# Altium schematic sheet STM-LF.SchDoc
size A4; SheetNumber: 2; SheetTotal: 6
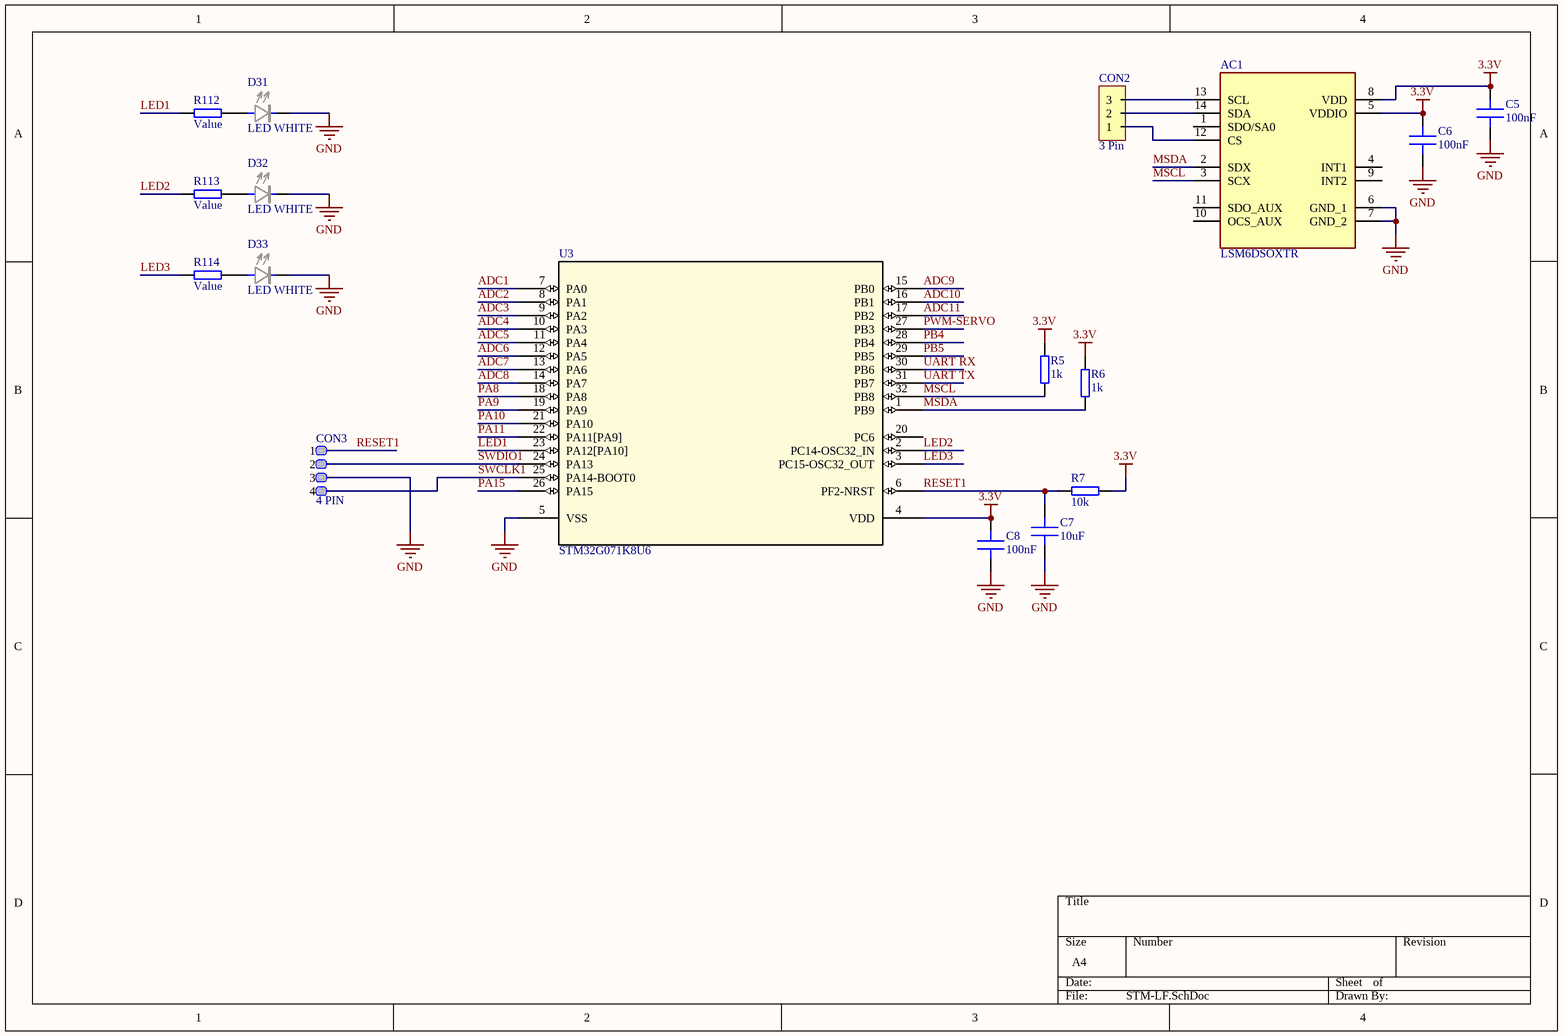
[diagram p0: STM-LF.SchDoc]

## Parts
AC1  LSM6DSOXTR  [LGA-14_1]
C5  100nF  [C 0603]
C6  100nF  [C 0603]
C7  10uF  [C 0603]
C8  100nF  [C 0603]
CON2  3 Pin  [BM03B-SRSS-TB]
CON3  4 PIN  [BM04B-SRSS-TB]
D31  LED WHITE  [LED 0603 White]
D32  LED WHITE  [LED 0603 White]
D33  LED WHITE  [LED 0603 White]
R5  1k  [R 0603]
R6  1k  [R 0603]
R7  10k  [R 0603]
R112  Value  [R 0603]
R113  Value  [R 0603]
R114  Value  [R 0603]
U3  STM32G071K8U6  [UFQFPN-32]

## Nets
3.3V: AC1.5(VDDIO) AC1.8(VDD) C5.2 C6.2 C8.2 R5.1 R6.1 R7.1 U3.4(VDD)
GND: AC1.6(GND_1) AC1.7(GND_2) C5.1 C6.1 C7.1 C8.1 CON3.3 D31.2 D32.2 D33.2 U3.5(VSS)
ADC1: U3.7(PA0)
ADC2: U3.8(PA1)
ADC3: U3.9(PA2)
ADC4: U3.10(PA3)
ADC5: U3.11(PA4)
ADC6: U3.12(PA5)
ADC7: U3.13(PA6)
ADC8: U3.14(PA7)
ADC9: U3.15(PB0)
ADC10: U3.16(PB1)
ADC11: U3.17(PB2)
LED1: R112.1 U3.23(PA12[PA10])
LED2: R113.1 U3.2(PC14-OSC32_IN)
LED3: R114.1 U3.3(PC15-OSC32_OUT)
MSCL: AC1.3(SCX) R5.2 U3.32(PB8)
MSDA: AC1.2(SDX) R6.2 U3.1(PB9)
PA8: U3.18(PA8)
PA9: U3.19(PA9)
PA10: U3.21(PA10)
PA11: U3.22(PA11[PA9])
PA15: U3.26(PA15)
PB4: U3.28(PB4)
PB5: U3.29(PB5)
PWM-SERVO: U3.27(PB3)
RESET1: C7.2 CON3.1 R7.2 U3.6(PF2-NRST)
SWCLK1: CON3.4 U3.25(PA14-BOOT0)
SWDIO1: CON3.2 U3.24(PA13)
UART RX: U3.30(PB6)
UART TX: U3.31(PB7)
NetAC1_12: AC1.12(CS) CON2.1
NetAC1_13: AC1.13(SCL) CON2.3
NetAC1_14: AC1.14(SDA) CON2.2
NetD31_1: D31.1 R112.2
NetD32_1: D32.1 R113.2
NetD33_1: D33.1 R114.2

Not connected (* = marked no-connect by the designer): AC1 1(SDO/SA0) 4(INT1) 9(INT2) 10(OCS_AUX) 11(SDO_AUX); U3 20(PC6)

## Library data of the parts
AC1 = LSM6DSOXTR: Accelerometer; Manufacturer_Name: STMicroelectronics; Datasheet Link: https://www.st.com/resource/en/datasheet/lsm6dsox.pdf; Manufacturer_Part_Number: LSM6DSOXTR; Mouser Part Number: 511-LSM6DSOXTR; Mouser Price/Stock: https://www.mouser.co.uk/ProductDetail/STMicroelectronics/LSM6DSOXTR?qs=l7cgNqFNU1i9dcjzItLpVQ%3D%3D; Arrow Part Number: LSM6DSOXTR; Arrow Price/Stock: https://www.arrow.com/en/products/lsm6dsoxtr/stmicroelectronics
C5-C8 = Capacitor: MLCC Capacitor
R5-R7 R112-R114 = Resistor: General pourpouse resistor
U3 = STM32G071K8U6: No Description Available; Mfr_Name: STMicroelectronics; Copyright: Copyright (C) 2024 Ultra Librarian. All rights reserved.; Manufacturer_Part_Number: STM32G071K8U6; RefDes: RefDes; Type: DEV